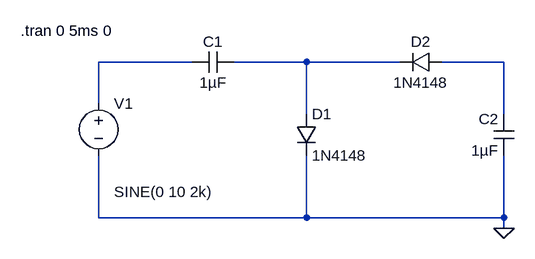
[diagram p0: schematic Midterm01.asc]
Midterm01.asc, the LTspice schematic file:
Version 4
SHEET 1 880 680
WIRE 224 64 80 64
WIRE 400 64 288 64
WIRE 544 64 400 64
WIRE 704 64 608 64
WIRE 80 128 80 64
WIRE 400 144 400 64
WIRE 704 144 704 64
WIRE 80 304 80 208
WIRE 400 304 400 208
WIRE 400 304 80 304
WIRE 704 304 704 208
WIRE 704 304 400 304
WIRE 704 320 704 304
FLAG 704 320 0
SYMBOL voltage 80 112 R0
WINDOW 3 24 152 Left 2
WINDOW 123 24 124 Left 2
WINDOW 39 0 0 Left 0
SYMATTR Value SINE(0 10 2k)
SYMATTR InstName V1
SYMBOL diode 384 144 R0
SYMATTR InstName D1
SYMATTR Value 1N4148
SYMBOL diode 608 48 R90
WINDOW 0 0 32 VBottom 2
WINDOW 3 32 32 VTop 2
SYMATTR InstName D2
SYMATTR Value 1N4148
SYMBOL cap 288 48 R90
WINDOW 0 0 32 VBottom 2
WINDOW 3 32 32 VTop 2
SYMATTR InstName C1
SYMATTR Value 1µF
SYMBOL cap 720 208 R180
WINDOW 0 24 56 Left 2
WINDOW 3 24 8 Left 2
SYMATTR InstName C2
SYMATTR Value 1µF
TEXT -40 16 Left 2 !.tran 0 5ms 0

The netlist it stands for:
* Midterm01.asc
V1 N001 0 SINE(0 10 2k)
D1 N002 0 1N4148
D2 N003 N002 1N4148
C1 N002 N001 1µF
C2 0 N003 1µF
.model D D
.lib standard.dio
.tran 0 5ms 0
.backanno
.end